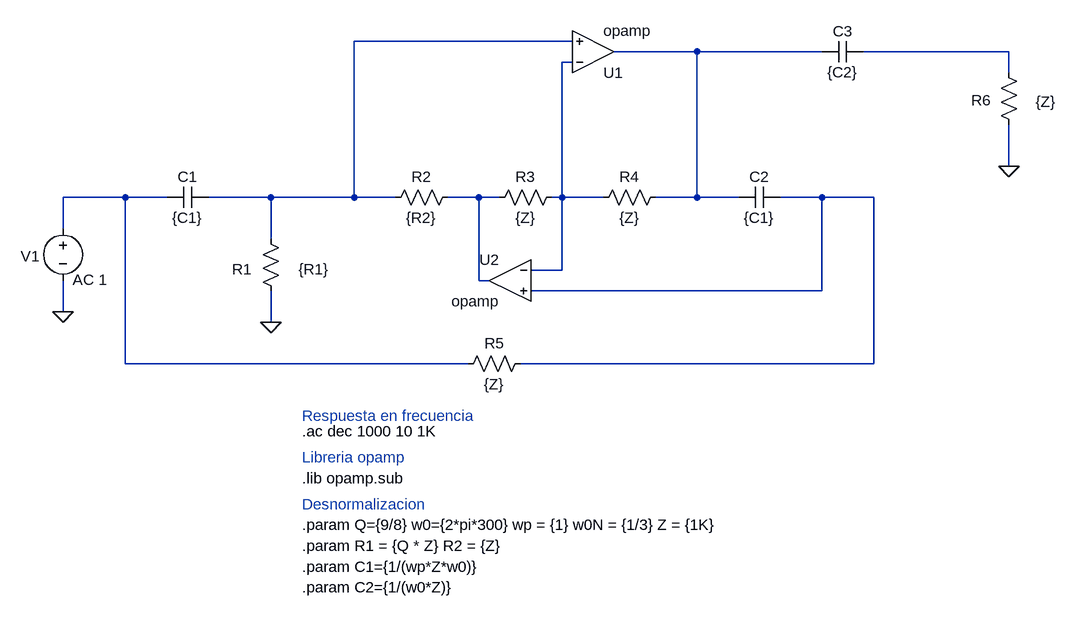
[diagram p0: schematic Circuito_Semana_5.asc]
Circuito_Semana_5.asc, the LTspice schematic file:
Version 4
SHEET 1 968 1144
WIRE -2080 -400 -2416 -400
WIRE -1888 -384 -2016 -384
WIRE -1696 -384 -1888 -384
WIRE -1408 -384 -1632 -384
WIRE -2080 -368 -2096 -368
WIRE -1408 -352 -1408 -384
WIRE -1408 -208 -1408 -272
WIRE -2768 -160 -2864 -160
WIRE -2704 -160 -2768 -160
WIRE -2544 -160 -2640 -160
WIRE -2416 -160 -2416 -400
WIRE -2416 -160 -2544 -160
WIRE -2352 -160 -2416 -160
WIRE -2224 -160 -2272 -160
WIRE -2192 -160 -2224 -160
WIRE -2096 -160 -2096 -368
WIRE -2096 -160 -2112 -160
WIRE -2032 -160 -2096 -160
WIRE -1888 -160 -1888 -384
WIRE -1888 -160 -1952 -160
WIRE -1824 -160 -1888 -160
WIRE -1696 -160 -1760 -160
WIRE -1616 -160 -1696 -160
WIRE -2864 -112 -2864 -160
WIRE -2544 -96 -2544 -160
WIRE -2096 -48 -2096 -160
WIRE -2096 -48 -2144 -48
WIRE -2224 -32 -2224 -160
WIRE -2208 -32 -2224 -32
WIRE -1696 -16 -1696 -160
WIRE -1696 -16 -2144 -16
WIRE -2864 16 -2864 -32
WIRE -2544 32 -2544 -16
WIRE -2768 96 -2768 -160
WIRE -2240 96 -2768 96
WIRE -1616 96 -1616 -160
WIRE -1616 96 -2160 96
FLAG -2864 16 0
FLAG -2544 32 0
FLAG -1408 -208 0
SYMBOL res -2528 0 R180
WINDOW 0 45 49 Left 2
WINDOW 3 -74 49 Left 2
SYMATTR InstName R1
SYMATTR Value {R1}
SYMBOL cap -1760 -176 R90
WINDOW 0 0 32 VBottom 2
WINDOW 3 32 32 VTop 2
SYMATTR InstName C2
SYMATTR Value {C1}
SYMBOL OpAmps\\opamp -2048 -320 M180
SYMATTR InstName U1
SYMBOL voltage -2864 -128 R0
WINDOW 0 -65 59 Left 2
WINDOW 3 41 58 Left 2
WINDOW 123 15 95 Left 2
WINDOW 39 0 0 Left 0
SYMATTR InstName V1
SYMATTR Value ""
SYMATTR Value2 AC 1
SYMBOL res -2256 -176 R90
WINDOW 0 0 56 VBottom 2
WINDOW 3 32 56 VTop 2
SYMATTR InstName R2
SYMATTR Value {R2}
SYMBOL res -1936 -176 R90
WINDOW 0 0 56 VBottom 2
WINDOW 3 32 56 VTop 2
SYMATTR InstName R4
SYMATTR Value {Z}
SYMBOL res -2096 -176 R90
WINDOW 0 0 56 VBottom 2
WINDOW 3 32 56 VTop 2
SYMATTR InstName R3
SYMATTR Value {Z}
SYMBOL res -2256 112 R270
WINDOW 0 32 56 VTop 2
WINDOW 3 0 56 VBottom 2
SYMATTR InstName R5
SYMATTR Value {Z}
SYMBOL OpAmps\\opamp -2176 -96 M0
SYMATTR InstName U2
SYMBOL cap -2640 -176 R90
WINDOW 0 0 32 VBottom 2
WINDOW 3 32 32 VTop 2
SYMATTR InstName C1
SYMATTR Value {C1}
SYMBOL res -1392 -256 R180
WINDOW 0 43 53 Left 2
WINDOW 3 -57 51 Left 2
SYMATTR InstName R6
SYMATTR Value {Z}
SYMBOL cap -1632 -400 R90
WINDOW 0 0 32 VBottom 2
WINDOW 3 32 32 VTop 2
SYMATTR InstName C3
SYMATTR Value {C2}
TEXT -2496 200 Left 2 !.ac dec 1000 10 1K
TEXT -2496 272 Left 2 !.lib opamp.sub
TEXT -2496 176 Left 2 ;Respuesta en frecuencia
TEXT -2496 240 Left 2 ;Libreria opamp
TEXT -2496 344 Left 2 !.param Q={9/8} w0={2*pi*300} wp = {1} w0N = {1/3} Z = {1K}
TEXT -2496 408 Left 2 !.param C1={1/(wp*Z*w0)}
TEXT -2496 312 Left 2 ;Desnormalizacion
TEXT -2496 440 Left 2 !.param C2={1/(w0*Z)}
TEXT -2496 376 Left 2 !.param R1 = {Q * Z} R2 = {Z}

The netlist it stands for:
* Circuito_Semana_5.asc
R1 0 N001 {R1}
C2 N007 N002 {C1}
XU1 N004 N001 N002 opamp Aol=100K GBW=10Meg  ; pins invin noninvin out
V1 N005 0 AC 1
R2 N006 N001 {R2}
R4 N002 N004 {Z}
R3 N004 N006 {Z}
R5 N005 N007 {Z}
XU2 N004 N007 N006 opamp Aol=100K GBW=10Meg  ; pins invin noninvin out
C1 N001 N005 {C1}
R6 0 N003 {Z}
C3 N003 N002 {C2}
.ac dec 1000 10 1K
.lib opamp.sub
* Respuesta en frecuencia
* Libreria opamp
.param Q={9/8} w0={2*pi*300} wp = {1} w0N = {1/3} Z = {1K}
.param C1={1/(wp*Z*w0)}
* Desnormalizacion
.param C2={1/(w0*Z)}
.param R1 = {Q * Z} R2 = {Z}
.backanno
.end